# Altium schematic sheet LED-PCB_DIG0.SchDoc
size B; SheetNumber: 2; SheetTotal: 5
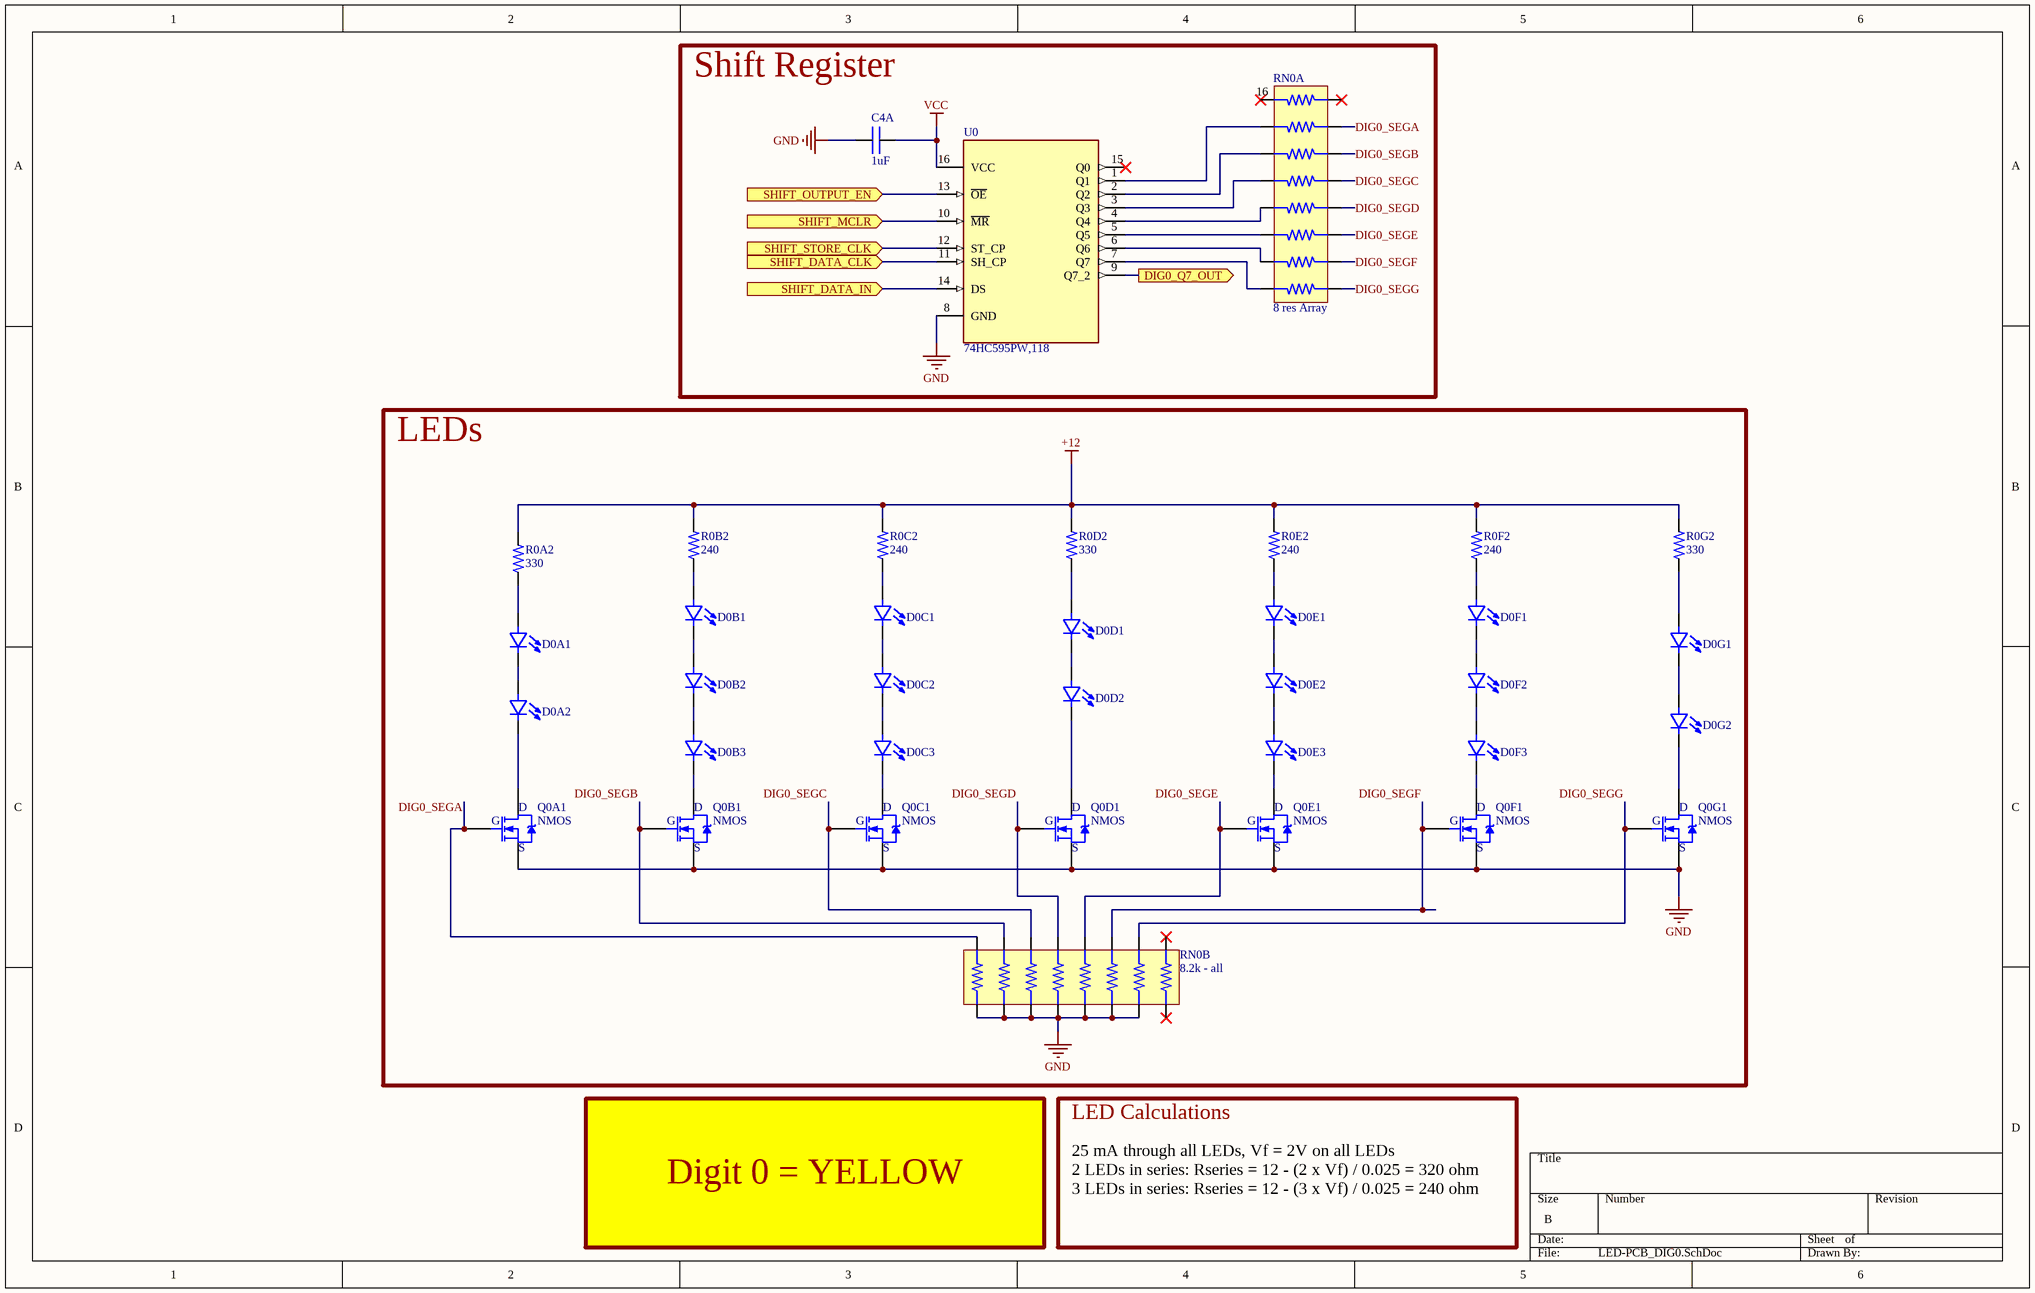
[diagram p0: LED-PCB_DIG0.SchDoc]

## Parts
C4A  value 1uF  [0402 CAP]  (hidden comment: CAP)
D0A1  LED - single  [LED - 0603]  (value not drawn)
D0A2  LED - single  [LED - 0603]  (value not drawn)
D0B1  LED - single  [LED - 0603]  (value not drawn)
D0B2  LED - single  [LED - 0603]  (value not drawn)
D0B3  LED - single  [LED - 0603]  (value not drawn)
D0C1  LED - single  [LED - 0603]  (value not drawn)
D0C2  LED - single  [LED - 0603]  (value not drawn)
D0C3  LED - single  [LED - 0603]  (value not drawn)
D0D1  LED - single  [LED - 0603]  (value not drawn)
D0D2  LED - single  [LED - 0603]  (value not drawn)
D0E1  LED - single  [LED - 0603]  (value not drawn)
D0E2  LED - single  [LED - 0603]  (value not drawn)
D0E3  LED - single  [LED - 0603]  (value not drawn)
D0F1  LED - single  [LED - 0603]  (value not drawn)
D0F2  LED - single  [LED - 0603]  (value not drawn)
D0F3  LED - single  [LED - 0603]  (value not drawn)
D0G1  LED - single  [LED - 0603]  (value not drawn)
D0G2  LED - single  [LED - 0603]  (value not drawn)
Q0A1  NMOS  [SOT-23]
Q0B1  NMOS  [SOT-23]
Q0C1  NMOS  [SOT-23]
Q0D1  NMOS  [SOT-23]
Q0E1  NMOS  [SOT-23]
Q0F1  NMOS  [SOT-23]
Q0G1  NMOS  [SOT-23]
R0A2  value 330  [0402 RES]  (hidden comment: RES)
R0B2  value 240  [0402 RES]  (hidden comment: RES)
R0C2  value 240  [0402 RES]  (hidden comment: RES)
R0D2  value 330  [0402 RES]  (hidden comment: RES)
R0E2  value 240  [0402 RES]  (hidden comment: RES)
R0F2  value 240  [0402 RES]  (hidden comment: RES)
R0G2  value 330  [0402 RES]  (hidden comment: RES)
RN0A  8 res Array  [EXB2HV331JV]
RN0B  8.2k - all  [MNR18ERAPJ822]
U0  74HC595PW,118  [16-TSSOP]

## Blocks framed on the sheet
Shift Register: C4A RN0A U0
LEDs: D0A1 D0A2 D0B1-D0B3 D0C1-D0C3 D0D1 D0D2 D0E1-D0E3 D0F1-D0F3 D0G1 D0G2 Q0A1 Q0B1 Q0C1 Q0D1 Q0E1 Q0F1 Q0G1 R0A2 R0B2 R0C2 R0D2 R0E2 R0F2 R0G2 RN0B

## Ports
DIG0_Q7_OUT (out, see LED-PCB_Master[1B], LED-PCB_DIG1[3A]), SHIFT_DATA_CLK (in, see LED-PCB_Master[1A], LED-PCB_DIG1[3A], LED-PCB_DIG2[3A], LED-PCB_DIG3[2B]), SHIFT_DATA_IN (in, see LED-PCB_Master[1A]), SHIFT_MCLR (in, see LED-PCB_Master[1A], LED-PCB_DIG1[3A], LED-PCB_DIG2[3A], LED-PCB_DIG3[2B]), SHIFT_OUTPUT_EN (in, see LED-PCB_Master[1B], LED-PCB_DIG1[3A], LED-PCB_DIG2[3A], LED-PCB_DIG3[2B]), SHIFT_STORE_CLK (in, see LED-PCB_Master[1A], LED-PCB_DIG1[3A], LED-PCB_DIG2[3A], LED-PCB_DIG3[2B])

## Nets
+12: R0A2.2 R0B2.2 R0C2.2 R0D2.2 R0E2.2 R0F2.2 R0G2.2
GND: C4A.1 Q0A1.2(S) Q0B1.2(S) Q0C1.2(S) Q0D1.2(S) Q0E1.2(S) Q0F1.2(S) Q0G1.2(S) RN0B.1 RN0B.2 RN0B.3 RN0B.4 RN0B.5 RN0B.6 RN0B.7 U0.8(GND)
VCC: C4A.2 U0.16(VCC)
DIG0_Q7_OUT: U0.9(Q7_2) ; port DIG0_Q7_OUT
DIG0_SEGA: Q0A1.1(G) RN0A.2 RN0B.16
DIG0_SEGB: Q0B1.1(G) RN0A.3 RN0B.15
DIG0_SEGC: Q0C1.1(G) RN0A.4 RN0B.14
DIG0_SEGD: Q0D1.1(G) RN0A.5 RN0B.13
DIG0_SEGE: Q0E1.1(G) RN0A.6 RN0B.12
DIG0_SEGF: Q0F1.1(G) RN0A.7 RN0B.11
DIG0_SEGG: Q0G1.1(G) RN0A.8 RN0B.10
SHIFT_DATA_CLK: U0.11(SH_CP) ; port SHIFT_DATA_CLK
SHIFT_DATA_IN: U0.14(DS) ; port SHIFT_DATA_IN
SHIFT_MCLR: U0.10(~{MR}) ; port SHIFT_MCLR
SHIFT_OUTPUT_EN: U0.13(~{OE}) ; port SHIFT_OUTPUT_EN
SHIFT_STORE_CLK: U0.12(ST_CP) ; port SHIFT_STORE_CLK
NetD0A1_1: D0A1.1(A) R0A2.1
NetD0A1_2: D0A1.2(C) D0A2.1(A)
NetD0A2_2: D0A2.2(C) Q0A1.3(D)
NetD0B1_1: D0B1.1(A) R0B2.1
NetD0B1_2: D0B1.2(C) D0B2.1(A)
NetD0B2_2: D0B2.2(C) D0B3.1(A)
NetD0B3_2: D0B3.2(C) Q0B1.3(D)
NetD0C1_1: D0C1.1(A) R0C2.1
NetD0C1_2: D0C1.2(C) D0C2.1(A)
NetD0C2_2: D0C2.2(C) D0C3.1(A)
NetD0C3_2: D0C3.2(C) Q0C1.3(D)
NetD0D1_1: D0D1.1(A) R0D2.1
NetD0D1_2: D0D1.2(C) D0D2.1(A)
NetD0D2_2: D0D2.2(C) Q0D1.3(D)
NetD0E1_1: D0E1.1(A) R0E2.1
NetD0E1_2: D0E1.2(C) D0E2.1(A)
NetD0E2_2: D0E2.2(C) D0E3.1(A)
NetD0E3_2: D0E3.2(C) Q0E1.3(D)
NetD0F1_1: D0F1.1(A) R0F2.1
NetD0F1_2: D0F1.2(C) D0F2.1(A)
NetD0F2_2: D0F2.2(C) D0F3.1(A)
NetD0F3_2: D0F3.2(C) Q0F1.3(D)
NetD0G1_1: D0G1.1(A) R0G2.1
NetD0G1_2: D0G1.2(C) D0G2.1(A)
NetD0G2_2: D0G2.2(C) Q0G1.3(D)
NetRN0A_9: RN0A.9 U0.7(Q7)
NetRN0A_10: RN0A.10 U0.6(Q6)
NetRN0A_11: RN0A.11 U0.5(Q5)
NetRN0A_12: RN0A.12 U0.4(Q4)
NetRN0A_13: RN0A.13 U0.3(Q3)
NetRN0A_14: RN0A.14 U0.2(Q2)
NetRN0A_15: RN0A.15 U0.1(Q1)

Not connected (* = marked no-connect by the designer): RN0A 1* 16*; RN0B 8* 9*; U0 15(Q0)*

## Notes on the sheet
- LED Calculations
- Digit 0 = YELLOW
- 25 mA through all LEDs, Vf = 2V on all LEDs
  2 LEDs in series: Rseries = 12 - (2 x Vf) / 0.025 = 320 ohm
  3 LEDs in series: Rseries = 12 - (3 x Vf) / 0.025 = 240 ohm

## Library data of the parts
C4A = CAP: Capaicitor; MFR PN: CL05A105KP5NNNC; MFR: Samsung Electro-Mechanics
D0A1 D0A2 D0B1-D0B3 D0C1-D0C3 D0D1 D0D2 D0E1-D0E3 D0F1-D0F3 D0G1 D0G2 = LED - single: MFR PN: 150060RS75000; MFR: Wurth Elektronik; Color: Red
Q0A1 Q0B1 Q0C1 Q0D1 Q0E1 Q0F1 Q0G1 = NMOS: N-Channel MOSFET; MFR PN: DMN63D8L-7; MFR: Diodes Incorporated
R0A2 R0D2 R0G2 = RES: Resistor; MFR PN: RC0402JR-13330RL; MFR: YAGEO
R0B2 R0C2 R0E2 R0F2 = RES: Resistor; MFR PN: RC0402FR-07240RL; MFR: YAGEO
RN0A = 8 res Array: MFR PN: EXB-2HV331JV; MFR: Panasonic Electronic Components; Value: 330; Vendor: *; Vendor PN: *; ComponentLink1Description: New link; ComponentLink1URL: *; ComponentLink2Description: New link 1; ComponentLink2URL: *; Vendor Link: *
RN0B = MNR18ERAPJ822: 8.2k Ohm ±5% 62.5mW Power Per Element Isolated 8 Resistor Network/Array ±250ppm/°C 1606, Convex, Long Side Terminals; MFR: Rohm Semiconductor; MFR PN: MNR18ERAPJ822
U0 = 74HC595PW,118: Shift Shift Register 1 Element 8 Bit 16-TSSOP; MFR: Nexperia USA; MFR PN: 74HC595PW,118